# Altium schematic sheet RGB_LED_3.SchDoc
size A4
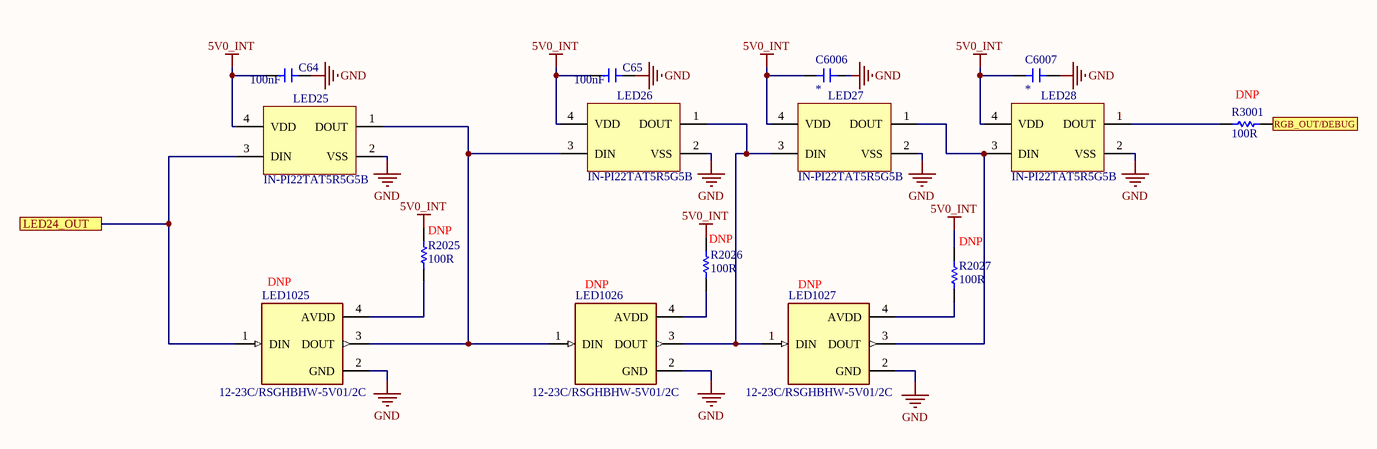
[diagram p0: RGB_LED_3.SchDoc]

## Parts
C64  value 100nF  [CAP_0402_CER]  (hidden comment: CL05B104KP5NNNC)
C65  value 100nF  [CAP_0402_CER]  (hidden comment: CL05B104KP5NNNC)
C6006  *  [CAP_0402_CER]
C6007  *  [CAP_0402_CER]
LED25  IN-PI22TAT5R5G5B  [RGB_IN-PI22TAT5R5G5B]
LED26  IN-PI22TAT5R5G5B  [RGB_IN-PI22TAT5R5G5B]
LED27  IN-PI22TAT5R5G5B  [RGB_IN-PI22TAT5R5G5B]
LED28  IN-PI22TAT5R5G5B  [RGB_IN-PI22TAT5R5G5B]
LED1025  12-23C/RSGHBHW-5V01/2C  Place: DNP  [LED_12-23C/RSGHBHW-5V01/2C]  (no BOM)
LED1026  12-23C/RSGHBHW-5V01/2C  Place: DNP  [LED_12-23C/RSGHBHW-5V01/2C]  (no BOM)
LED1027  12-23C/RSGHBHW-5V01/2C  Place: DNP  [LED_12-23C/RSGHBHW-5V01/2C]  (no BOM)
R2025  value 100R  Place: DNP  [RES_0402_SMD]  (hidden comment: RMCF0402JT100R)  (no BOM)
R2026  value 100R  Place: DNP  [RES_0402_SMD]  (hidden comment: RMCF0402JT100R)  (no BOM)
R2027  value 100R  Place: DNP  [RES_0402_SMD]  (hidden comment: RMCF0402JT100R)  (no BOM)
R3001  value 100R  Place: DNP  [RES_0402_SMD]  (hidden comment: RMCF0402JT100R)  (no BOM)

## Ports
LED24_OUT, RGB_OUT/DEBUG

## Nets
5V0_INT: C64.2 C65.2 C6006.1 C6007.1 LED25.4(VDD) LED26.4(VDD) LED27.4(VDD) LED28.4(VDD) R2025.1 R2026.1 R2027.1
GND: C64.1 C65.1 C6006.2 C6007.2 LED25.2(VSS) LED26.2(VSS) LED27.2(VSS) LED28.2(VSS) LED1025.2(GND) LED1026.2(GND) LED1027.2(GND)
LED24_OUT: LED25.3(DIN) LED1025.1(DIN) ; port LED24_OUT
RGB_OUT/DEBUG: R3001.2 ; port RGB_OUT/DEBUG
NetLED25_1: LED25.1(DOUT) LED26.3(DIN) LED1025.3(DOUT) LED1026.1(DIN)
NetLED26_1: LED26.1(DOUT) LED27.3(DIN) LED1026.3(DOUT) LED1027.1(DIN)
NetLED27_1: LED27.1(DOUT) LED28.3(DIN) LED1027.3(DOUT)
NetLED28_1: LED28.1(DOUT) R3001.1
NetLED1025_4: LED1025.4(AVDD) R2025.2
NetLED1026_4: LED1026.4(AVDD) R2026.2
NetLED1027_4: LED1027.4(AVDD) R2027.2

## Library data of the parts
C64 C65 = CAP_GEN_CER: 100nF 0402 Ceramic Capacitor; Voltage: 10V; Place: POP; Part Number: CL05B104KP5NNNC; Power: *; Package: *; Tolerance: *; Operating Temp.: *
C6006 C6007 = CAP_GEN_CER: Generic; Part Number: *; Power: *; Package: *; Tolerance: *; Value: *; Voltage: *; Place: *; Operating Temp.: *
LED25-LED28 = IN-PI22TAT5R5G5B: ADDRESS LED DISCRETE SERIAL RGB; Manufacturer: Inolux; Place: P; Part Number: IN-PI22TAT5R5G5B; Operating Temp.: -40°C ~ 85°C; Power: N/A; Tolerance: N/A; Value: N/A; Voltage: N/A; Package: IN-PI22TAT5R5G5B
LED1025-LED1027 = 12-23C/RSGHBHW-5V01/2C: Addressable Lighting series 1 LED Discrete Serial (Shift Register) Red, Green, Blue (RGB) 3.00mm L x 1.00mm W; MF: Everlight Electronics Co Ltd; Package: SMD-4 Everlight Electronics Co Ltd; SnapEDA_Link: https://www.snapeda.com/parts/12-23C/RSGHBHW-5V01/2C/Everlight+Electronics+Co+Ltd/view-part/?ref=snap; MP: 12-23C/RSGHBHW-5V01/2C; Purchase-URL: https://pricing.snapeda.com/search/part/12-23C/RSGHBHW-5V01/2C/?ref=eda; Value: *; Availability: In Stock; Price: None; Check_prices: https://www.snapeda.com/parts/12-23C/RSGHBHW-5V01/2C/Everlight+Electronics+Co+Ltd/view-part/?ref=eda; Part Number: 12-23C/RSGHBHW-5V01/2C
R2025-R2027 R3001 = RES_GEN_SMD: Generic Chip Res 100R; Tolerance: 5 %; Package: *; Part Number: RMCF0402JT100R; Power: *; Voltage: *; Operating Temp.: *